# EAGLE design espruino (EAGLE 5.12)
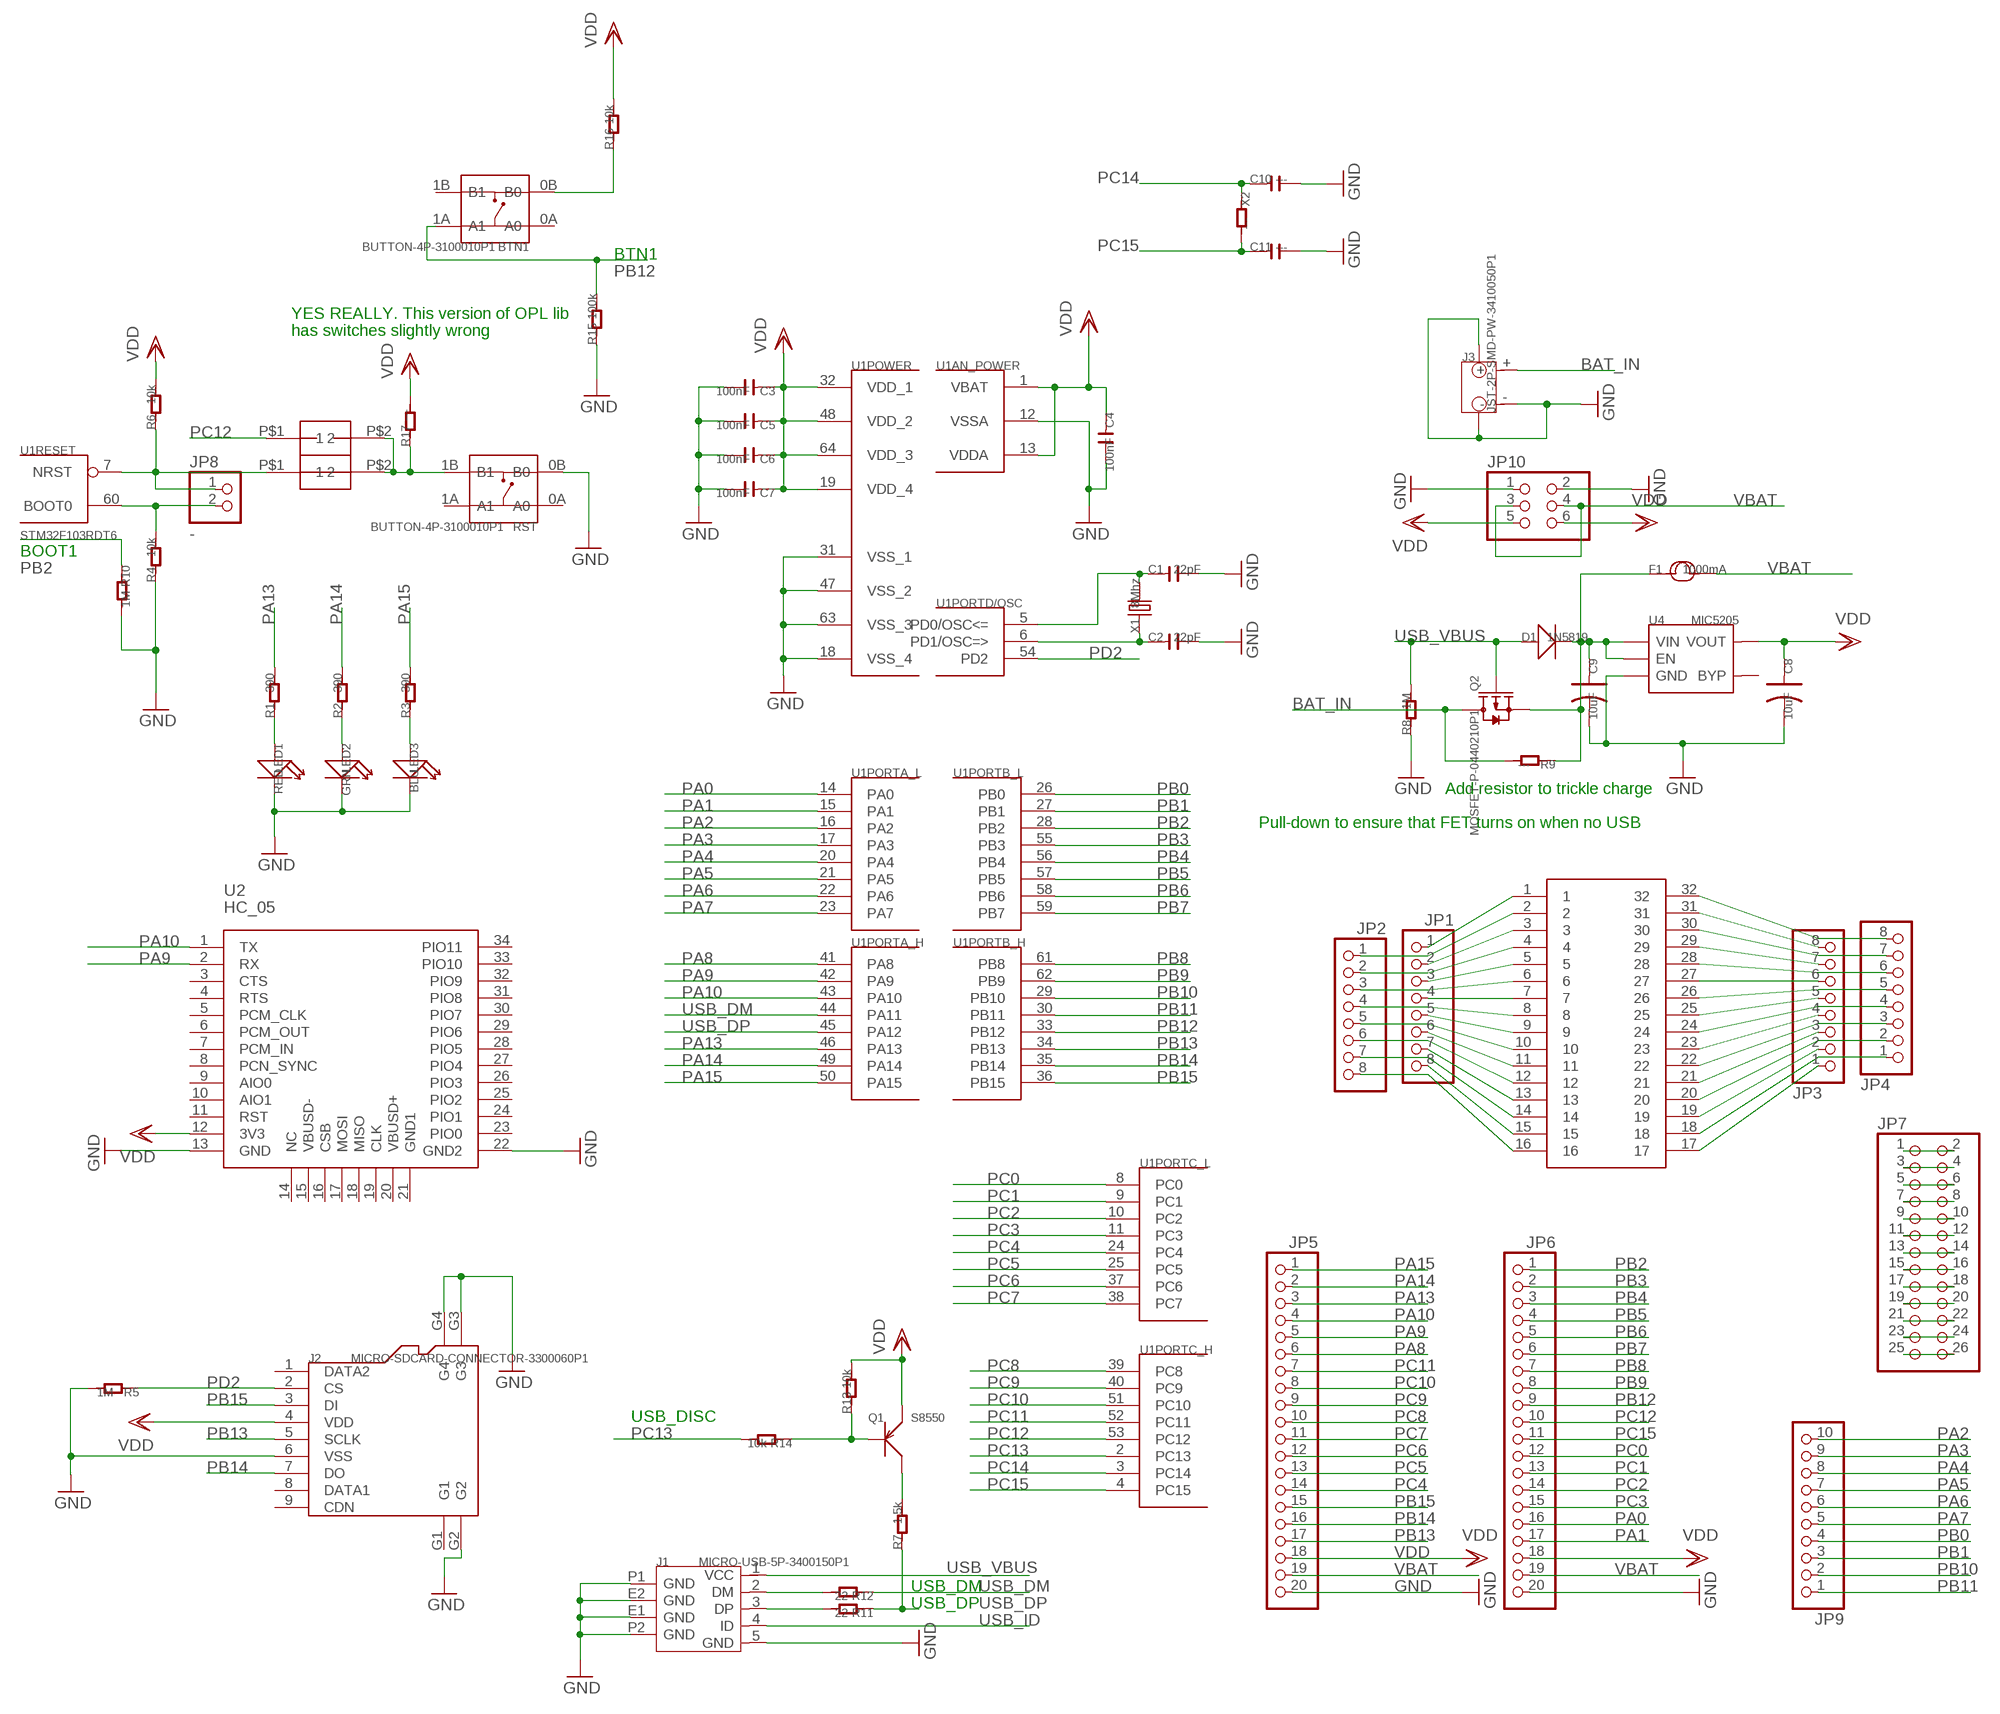
[diagram p0: schematic, sheet 1]

## Parts
BTN1  BUTTON-4P-3100010P1  [4P-SMD-6.0X6.0X5.0H]
C1  22pF  C-0603  [C0603]
C2  22pF  C-0603  [C0603]
C3  100nF  C-0603  [C0603]
C4  100nF  C-0603  [C0603]
C5  100nF  C-0603  [C0603]
C6  100nF  C-0603  [C0603]
C7  100nF  C-0603  [C0603]
C8  10uF  C-POLAR-A  [AVX-A]
C9  10uF  C-POLAR-A  [AVX-A]
C10  ---  C-0603  [C0603]
C11  ---  C-0603  [C0603]
D1  1N5819  D-SMA  [DO-214AC]
F1  1000mA  FUSE-1206  [F1206]
J1  MICRO-USB-5P-3400150P1  [B-SMD-5P]
J2  MICRO-SDCARD-CONNECTOR-3300060P1  [9P-SMD-W-RING]
J3  JST-2P-SMD-PW-3410050P1  [2P-SMD-2.0-90D]
JP1  PINHD-1X08_2.54-S  [1X08-S]
JP2  PINHD-1X08_2.54-S  [1X08-S]
JP3  PINHD-1X08_2.54-S  [1X08-S]
JP4  PINHD-1X08_2.54-S  [1X08-S]
JP5  PINHD-1X20_2.54-S  [1X20-S]
JP6  PINHD-1X20_2.54-S  [1X20-S]
JP7  PINHD-2X13_2.54  [2X13]
JP8  -  PINHD-1X02_2.54-S  [1X02-S]
JP9  PINHD-1X10_2.54-S  [1X10-S]
JP10  PINHD-2X3  [2X03]
LED1  RED  LED  [LED0603]
LED2  GRN  LED  [LED0603]
LED3  BLU  LED  [LED0603]
Q1  S8550  TRANSISTOR-PNP-0410030P1  [SOT23]
Q2  MOSFET-P-0440210P1  [SOT23]
R1  390  R-0603  [R0603]
R2  390  R-0603  [R0603]
R3  390  R-0603  [R0603]
R4  10k  R-0603  [R0603]
R5  1M  R-0603  [R0603]
R6  10k  R-0603  [R0603]
R7  1.5k  R-0603  [R0603]
R8  1M  R-0603  [R0603]
R9  ---  R-0603  [R0603]
R10  1M  R-0603  [R0603]
R11  22  R-0603  [R0603]
R12  22  R-0603  [R0603]
R13  10k  R-0603  [R0603]
R14  10k  R-0603  [R0603]
R15  100k  R-0603  [R0603]
R16  10k  R-0603  [R0603]
R17  ---  R-0603  [R0603]
RST  BUTTON-4P-3100010P1  [4P-SMD-6.0X6.0X5.0H]
U1  STM32F103RDT6  STM32F10XRXT6  [TQFP64]
U2  HC_05  [BLUETOOTH_SMD]
U4  MIC5205  MIC5205-3.3YM5-1300180P1  [SOT23-5]
U$1  SOIC32  [SO32X]
U$2  SOLDERJUMPER_SHORT  [SOLDERJUMPER_SHORT]
U$3  SOLDERJUMPER  [SOLDERJUMPER]
X1  8Mhz  CRYSTAL-0500290P1  [2P-SMD-5.0X3.2]
X2  ---  R-0603  [R0603]

## Nets
BAT_IN: J3.+ Q2.3(D) R9.2
GND: C1.2 C2.2 C3.2 C4.2 C5.2 C6.2 C7.2 C8.- C9.- C10.2 C11.2 J1.5(GND) J1.E1(GND) J1.E2(GND) J1.P1(GND) J1.P2(GND) J2.6(VSS) J2.G2 J2.G3 J2.G4 J3.3 J3.4 J3.- JP5.20 JP6.20 JP10.1 JP10.2 LED1.- LED2.- LED3.- R4.1 R5.2 R8.1 R10.2 R15.1 RST.0B(B0) U1.12(AN_POWER:VSSA) U1.18(POWER:VSS_4) U1.31(POWER:VSS_1) U1.47(POWER:VSS_2) U1.63(POWER:VSS_3) U2.13(GND) U2.22(GND2) U4.2(GND)
N$1: JP1.1 U$1.1
N$2: JP1.2 U$1.3
N$3: JP1.3 U$1.5
N$4: JP1.4 U$1.7
N$5: JP1.5 U$1.9
N$6: JP1.6 U$1.11
N$7: JP1.7 U$1.13
N$8: JP2.1 U$1.2
N$9: JP2.2 U$1.4
N$10: JP2.3 U$1.6
N$11: JP2.4 U$1.8
N$12: JP2.5 U$1.10
N$13: JP2.6 U$1.12
N$14: JP2.7 U$1.14
N$15: JP1.8 U$1.15
N$16: JP2.8 U$1.16
N$17: JP4.8 U$1.32
N$18: JP3.8 U$1.31
N$19: JP3.7 U$1.29
N$20: JP3.6 U$1.27
N$21: JP3.5 U$1.25
N$22: JP4.1 U$1.18
N$23: JP4.2 U$1.20
N$24: JP4.3 U$1.22
N$25: JP4.4 U$1.24
N$26: JP4.5 U$1.26
N$27: JP4.6 U$1.28
N$28: JP4.7 U$1.30
N$29: JP7.3 JP7.4
N$30: JP7.5 JP7.6
N$31: JP7.7 JP7.8
N$32: JP7.9 JP7.10
N$33: JP7.11 JP7.12
N$34: JP7.13 JP7.14
N$35: JP7.15 JP7.16
N$36: JP7.17 JP7.18
N$37: JP7.19 JP7.20
N$38: JP7.21 JP7.22
N$39: JP7.23 JP7.24
N$40: JP7.25 JP7.26
N$41: J1.3(DP) R11.2
N$42: J1.2(DM) R12.2
N$43: LED3.+ R3.1
N$44: JP3.4 U$1.23
N$45: JP8.1 R6.1 U1.7(RESET:NRST) U$2.P$1
N$46: JP8.2 R4.2 U1.60(RESET:BOOT0)
N$47: JP3.3 U$1.21
N$48: JP3.2 U$1.19
N$49: JP3.1 U$1.17
N$50: C2.1 U1.6(PORTD/OSC:PD1/OSC=>) X1.1
N$51: C1.1 U1.5(PORTD/OSC:PD0/OSC<=) X1.2
N$52: LED2.+ R2.1
N$53: LED1.+ R1.1
N$54: BTN1.0B(B0) R16.1
N$55: JP7.1 JP7.2
N$56: R17.1 RST.1B(B1) U$2.P$2 U$3.P$2
N$57: Q1.3(C) R7.2
N$58: C9.+ D1.2(-) F1.1 Q2.2(S) R9.1 U4.1(VIN) U4.3(EN)
N$59: Q1.1(B) R13.1 R14.1
PA0: JP6.16 U1.14(PORTA_L:PA0)
PA1: JP6.17 U1.15(PORTA_L:PA1)
PA2: JP9.10 U1.16(PORTA_L:PA2)
PA3: JP9.9 U1.17(PORTA_L:PA3)
PA4: JP9.8 U1.20(PORTA_L:PA4)
PA5: JP9.7 U1.21(PORTA_L:PA5)
PA6: JP9.6 U1.22(PORTA_L:PA6)
PA7: JP9.5 U1.23(PORTA_L:PA7)
PA8: JP5.6 U1.41(PORTA_H:PA8)
PA9: JP5.5 U1.42(PORTA_H:PA9) U2.2(RX)
PA10: JP5.4 U1.43(PORTA_H:PA10) U2.1(TX)
PA13: JP5.3 R1.2 U1.46(PORTA_H:PA13)
PA14: JP5.2 R2.2 U1.49(PORTA_H:PA14)
PA15: JP5.1 R3.2 U1.50(PORTA_H:PA15)
PB0: JP9.4 U1.26(PORTB_L:PB0)
PB1: JP9.3 U1.27(PORTB_L:PB1)
PB2: JP6.1 R10.1 U1.28(PORTB_L:PB2)
PB3: JP6.2 U1.55(PORTB_L:PB3)
PB4: JP6.3 U1.56(PORTB_L:PB4)
PB5: JP6.4 U1.57(PORTB_L:PB5)
PB6: JP6.5 U1.58(PORTB_L:PB6)
PB7: JP6.6 U1.59(PORTB_L:PB7)
PB8: JP6.7 U1.61(PORTB_H:PB8)
PB9: JP6.8 U1.62(PORTB_H:PB9)
PB10: JP9.2 U1.29(PORTB_H:PB10)
PB11: JP9.1 U1.30(PORTB_H:PB11)
PB12: BTN1.1A(A1) JP6.9 R15.2 U1.33(PORTB_H:PB12)
PB13: J2.5(SCLK) JP5.17 U1.34(PORTB_H:PB13)
PB14: J2.7(DO) JP5.16 U1.35(PORTB_H:PB14)
PB15: J2.3(DI) JP5.15 U1.36(PORTB_H:PB15)
PC0: JP6.12 U1.8(PORTC_L:PC0)
PC1: JP6.13 U1.9(PORTC_L:PC1)
PC2: JP6.14 U1.10(PORTC_L:PC2)
PC3: JP6.15 U1.11(PORTC_L:PC3)
PC4: JP5.14 U1.24(PORTC_L:PC4)
PC5: JP5.13 U1.25(PORTC_L:PC5)
PC6: JP5.12 U1.37(PORTC_L:PC6)
PC7: JP5.11 U1.38(PORTC_L:PC7)
PC8: JP5.10 U1.39(PORTC_H:PC8)
PC9: JP5.9 U1.40(PORTC_H:PC9)
PC10: JP5.8 U1.51(PORTC_H:PC10)
PC11: JP5.7 U1.52(PORTC_H:PC11)
PC12: JP6.10 U1.53(PORTC_H:PC12) U$3.P$1
PC13: R14.2 U1.2(PORTC_H:PC13)
PC14: C10.1 U1.3(PORTC_H:PC14) X2.1
PC15: C11.1 JP6.11 U1.4(PORTC_H:PC15) X2.2
PD2: J2.2(CS) R5.1 U1.54(PORTD/OSC:PD2)
USB_DM: R12.1 U1.44(PORTA_H:PA11)
USB_DP: R7.1 R11.1 U1.45(PORTA_H:PA12)
USB_ID: J1.4(ID)
USB_VBUS: D1.1(+) J1.1(VCC) Q2.1(G) R8.2
VBAT: F1.2 JP5.19 JP6.19 JP10.3 JP10.4
VDD: C3.1 C4.1 C5.1 C6.1 C7.1 C8.+ J2.4(VDD) JP5.18 JP6.18 JP10.5 JP10.6 Q1.2(E) R6.2 R13.2 R16.2 R17.2 U1.1(AN_POWER:VBAT) U1.13(AN_POWER:VDDA) U1.19(POWER:VDD_4) U1.32(POWER:VDD_1) U1.48(POWER:VDD_2) U1.64(POWER:VDD_3) U2.12(3V3) U4.5(VOUT)
Unconnected: BTN1.0A(A0) BTN1.1B(B1) J2.1(DATA2) J2.8(DATA1) J2.9(CDN) J2.G1 RST.0A(A0) RST.1A(A1) U2.3(CTS) U2.4(RTS) U2.5(PCM_CLK) U2.6(PCM_OUT) U2.7(PCM_IN) U2.8(PCN_SYNC) U2.9(AIO0) U2.10(AIO1) U2.11(RST) U2.14(NC) U2.15(VBUSD-) U2.16(CSB) U2.17(MOSI) U2.18(MISO) U2.19(CLK) U2.20(VBUSD+) U2.21(GND1) U2.23(PIO0) U2.24(PIO1) U2.25(PIO2) U2.26(PIO3) U2.27(PIO4) U2.28(PIO5) U2.29(PIO6) U2.30(PIO7) U2.31(PIO8) U2.32(PIO9) U2.33(PIO10) U2.34(PIO11) U4.4(BYP)

## Notes on the sheet
- BTN1
- YES REALLY. This version of OPL lib
- has switches slightly wrong
- BOOT1
- Add resistor to trickle charge
- Pull-down to ensure that FET turns on when no USB
- USB_DISC
- USB_DM
- USB_DP

## Library data of the parts
BTN1 RST = OPL5:BUTTON-4P
C1-C7 C10 C11 = OPL5:C*
C8 C9 = OPL5:C-POLAR*
D1 = OPL5:D*: DIODE
F1 = OPL5:FUSE*
J1 = OPL5:MICRO-USB-5P: ST-USB-001E?MICRO USB B SMD R/A
J2 = OPL5:MICRO-SDCARD-CONNECTOR: Micro SD Card
J3 = OPL5:JST-2P-SMD-PW
JP1-JP4 = pinhead-2:PINHD-1X08: PIN HEADER
JP5 JP6 = pinhead-2:PINHD-1X20: PIN HEADER
JP7 = pinhead-2:PINHD-2X13: PIN HEADER
JP8 = pinhead-2:PINHD-1X02: PIN HEADER
JP9 = pinhead-2:PINHD-1X10: PIN HEADER
JP10 = pinhead:PINHD-2X3: PIN HEADER
LED1-LED3 = OPL5:LED*: LED
Q1 = OPL5:TRANSISTOR-PNP*: S8550?PNP Transistor
Q2 = OPL5:MOSFET-P: CJ2305?SMD MOSFET P-CH 8V-4.1A
R1-R17 X2 = OPL5:R*
U1 = stm32:STM32F10XRXT6: STM32F101/103 64pin LQFP
U2 = bluetooth:HC_05
U4 = OPL5:MIC5205-3.3YM5: The MIC5205 is an efficient linear voltage regulator with ultra-low-noise output, very low dropout voltage (typically 17mV at light loads and 165mV at 150mA), and very low ground current (600µA at 100mA output). The MIC5205 offers better than 1% initial accuracy. datasheet here: http://www.micrel.com/product-info/prod/5205.shtml
U$1 = longpad:SOIC32
U$2 = solderjumper:SOLDERJUMPER_SHORT
U$3 = solderjumper:SOLDERJUMPER
X1 = OPL5:CRYSTAL*

## Board
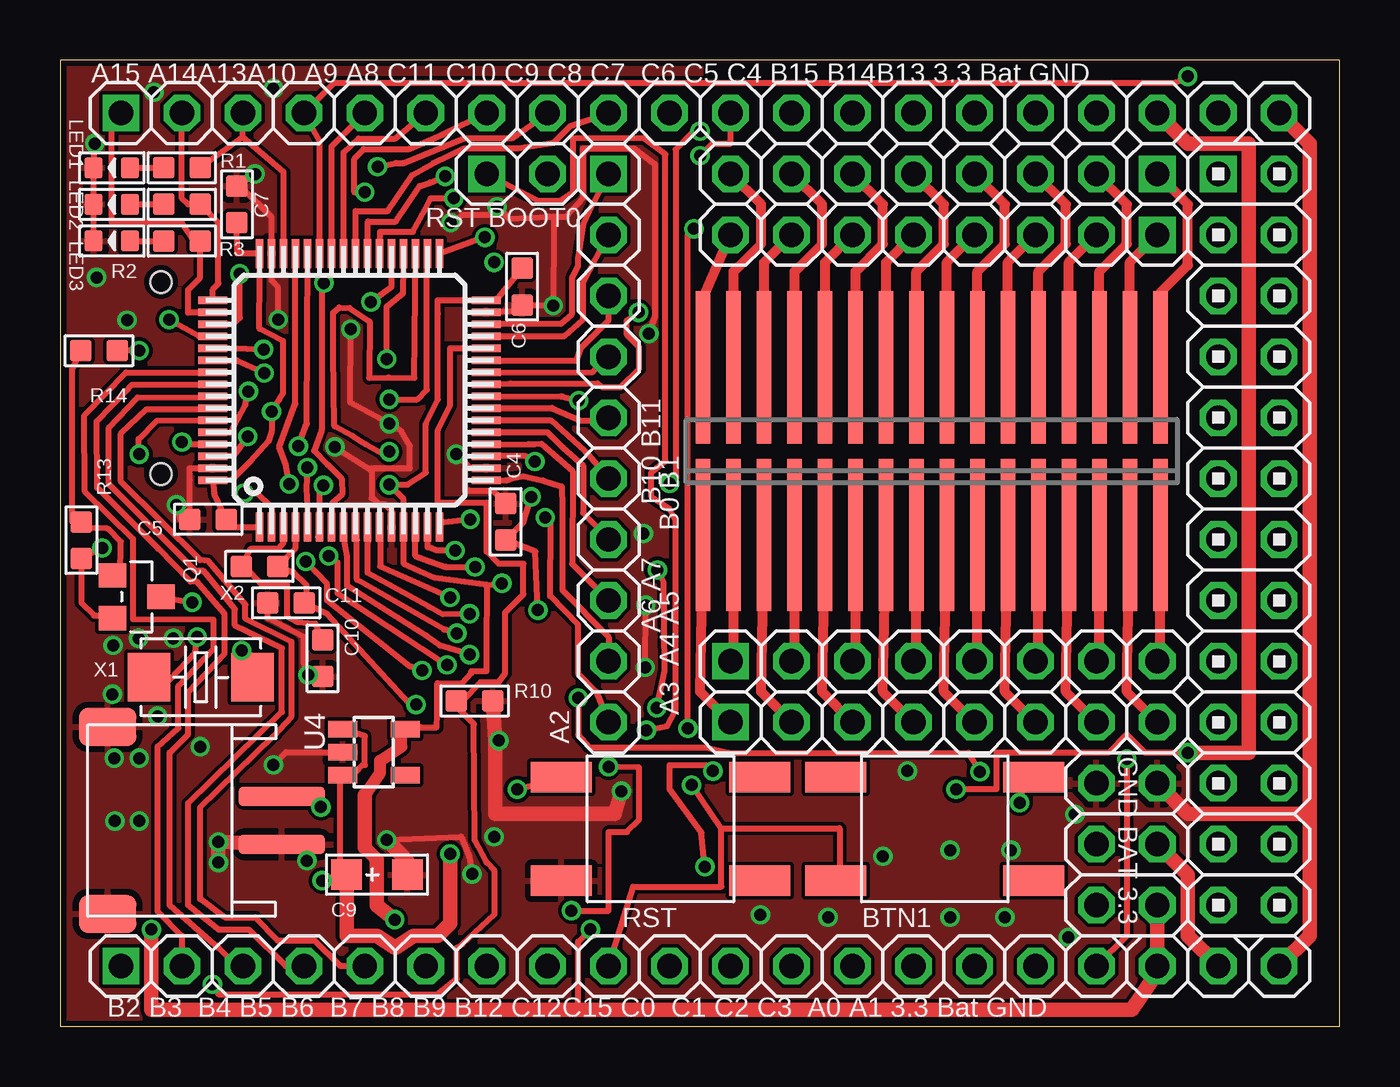
[diagram p1: board, top side]
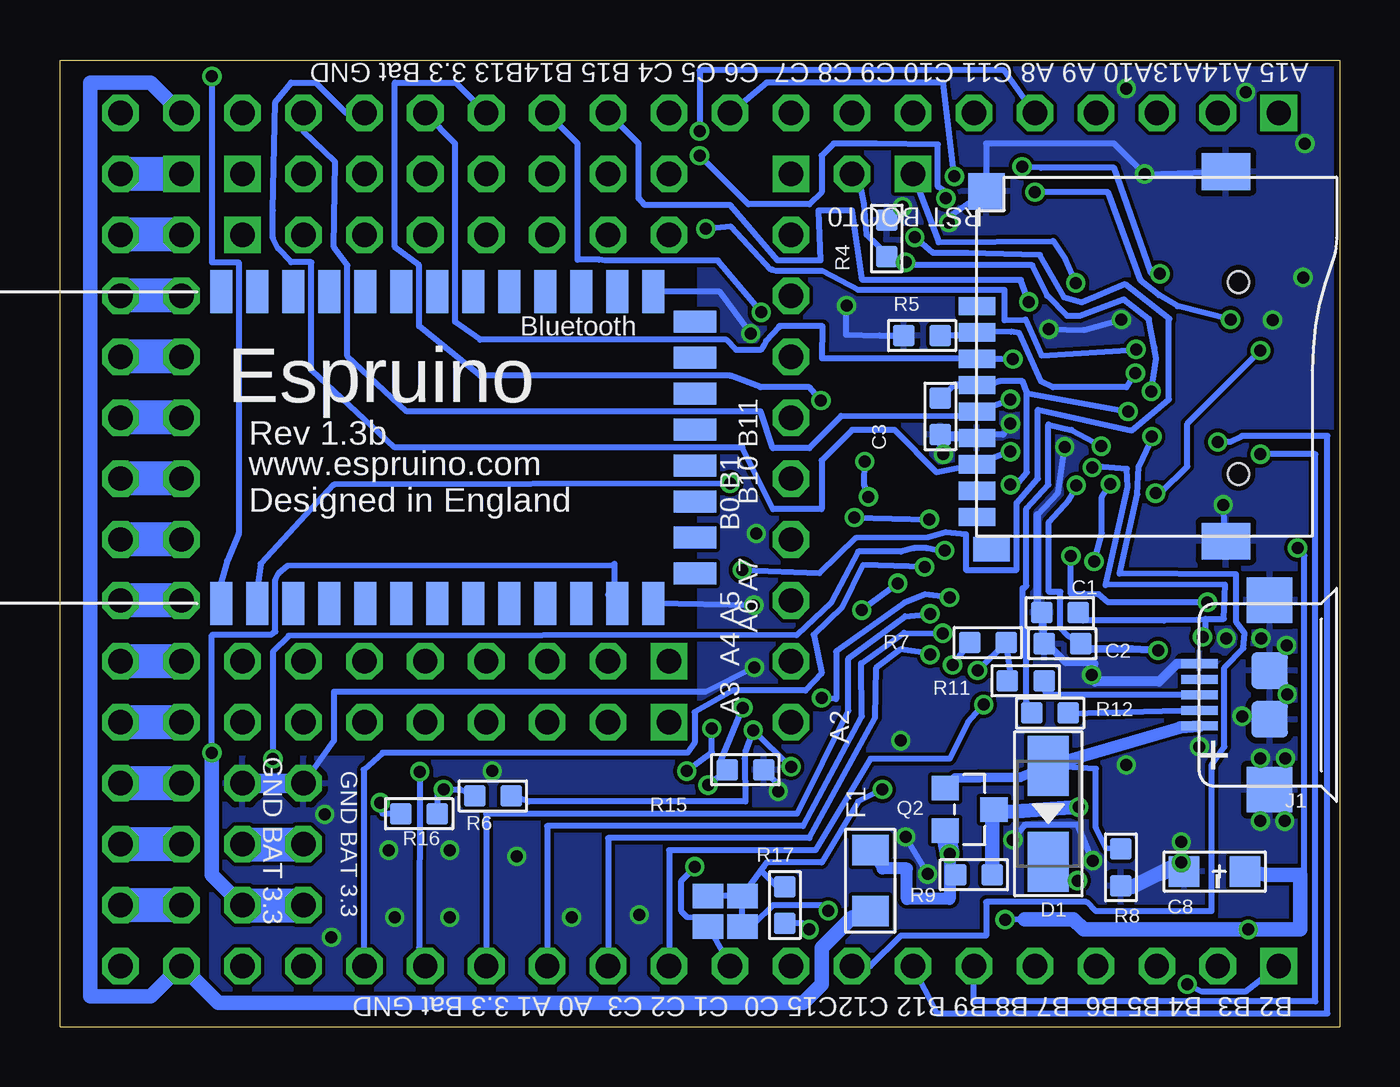
[diagram p2: board, bottom side, seen from below]

Size 53.32 x 40.31 mm. Coordinates in mm from the lower left corner, seen from the top.
Outline: 53.32,0 53.32,0
Outline: 53.32,0 53.32,40.31 0,40.31 0,0 53.32,0
Copper layers (1*16): Top 0.035mm / dielectric 1.5mm / Bottom 0.035mm
Design rules "SeeedStudio_rule_no_angle_090911 *": minimum track width 6mil, minimum drill 12mil, track to track 6mil, track to pad 6mil, pad to pad 6mil, via to via 6mil, smd to smd 0mil, copper to edge 10mil, drill to drill 10mil, minimum pad ring 10mil, minimum via ring 6mil, stop-mask expansion 2mil, vias tented up to drill 100mil, thermal gap 10mil

### Footprints (pad centres in the part's own frame; a part is rotated, then mirrored left to right if it is on the bottom)
4P-SMD-6.0X6.0X5.0H = smd 2.54 x 1.27: 0A -4.129,2.159; 0B 4.129,2.159; 1A -4.129,-2.159; 1B 4.129,-2.159
C0603 = smd 0.889 x 0.889: 1 -0.762,0; 2 0.762,0
AVX-A = smd 1.27 x 1.27: + -1.27,0; - 1.27,0
DO-214AC = smd 2.5 x 1.7: 1 -2,0; 2 2,0
F1206 = smd 1.27 x 1.524: 1 -1.27,0; 2 1.27,0
B-SMD-5P = smd 0.38 x 1.52: 1 -1.3,2.54; 2 -0.65,2.54; 3 0,2.54; 4 0.65,2.54; 5 1.3,2.54 | smd 1.524 x 1.524: E1 -1.016,-0.381; E2 1.016,-0.381 | smd 1.9 x 1.9: P1 -3.95,-0.381; P2 3.95,-0.381
9P-SMD-W-RING = smd 1.524 x 0.762: 1 -7.493,2.114; 2 -7.493,1.014; 3 -7.493,-0.086; 4 -7.493,-1.186; 5 -7.493,-2.286; 6 -7.493,-3.386; 7 -7.493,-4.486; 8 -7.493,-5.586; 9 -7.493,-6.686 | smd 1.524 x 1.016: G1 -6.893,-8.032 | smd 2.032 x 1.524: G2 2.88,-7.686; G3 2.88,7.714 | smd 1.524 x 1.524: G4 -7.101,6.895 | hole 0.889: 3.407,-4.886; 3.407,3.114
2P-SMD-2.0-90D = smd 1.6 x 2.4: 3 3.9,-2.181; 4 -3.9,-2.181 | smd 0.8 x 3.6: + -1,5.08; - 1,5.08
1X08-S = drill 1.016 square: 1 -8.89,0 | drill 1.016 octagon: 2 -6.35,0; 3 -3.81,0; 4 -1.27,0; 5 1.27,0; 6 3.81,0; 7 6.35,0; 8 8.89,0
1X20-S = drill 1.016 square: 1 -24.13,0 | drill 1.016 octagon: 2 -21.59,0; 3 -19.05,0; 4 -16.51,0; 5 -13.97,0; 6 -11.43,0; 7 -8.89,0; 8 -6.35,0; 9 -3.81,0; 10 -1.27,0; 11 1.27,0; 12 3.81,0; 13 6.35,0; 14 8.89,0; 15 11.43,0; 16 13.97,0; 17 16.51,0; 18 19.05,0; 19 21.59,0; 20 24.13,0
2X13 = drill 1.016 square: 1 -15.24,-1.27 | drill 1.016 octagon: 2 -15.24,1.27; 3 -12.7,-1.27; 4 -12.7,1.27; 5 -10.16,-1.27; 6 -10.16,1.27; 7 -7.62,-1.27; 8 -7.62,1.27; 9 -5.08,-1.27; 10 -5.08,1.27; 11 -2.54,-1.27; 12 -2.54,1.27; 13 0,-1.27; 14 0,1.27; 15 2.54,-1.27; 16 2.54,1.27; 17 5.08,-1.27; 18 5.08,1.27; 19 7.62,-1.27; 20 7.62,1.27; 21 10.16,-1.27; 22 10.16,1.27; 23 12.7,-1.27; 24 12.7,1.27; 25 15.24,-1.27; 26 15.24,1.27
1X02-S = drill 1.016 square: 1 -1.27,0 | drill 1.016 octagon: 2 1.27,0
1X10-S = drill 1.016 square: 1 -11.43,0 | drill 1.016 octagon: 2 -8.89,0; 3 -6.35,0; 4 -3.81,0; 5 -1.27,0; 6 1.27,0; 7 3.81,0; 8 6.35,0; 9 8.89,0; 10 11.43,0
2X03 = drill 1.016 octagon: 1 -2.54,-1.27; 2 -2.54,1.27; 3 0,-1.27; 4 0,1.27; 5 2.54,-1.27; 6 2.54,1.27
LED0603 = smd 0.762 x 0.889: + -0.762,0; - 0.762,0
SOT23 = smd 1.016 x 1.143: 1 -0.889,-1.016; 2 0.889,-1.016; 3 0,1.016
R0603 = smd 0.889 x 0.889: 1 -0.762,0; 2 0.762,0
TQFP64 = smd 1.2 x 0.3: 1 -5.7,3.75; 2 -5.7,3.25; 3 -5.7,2.75; 4 -5.7,2.25; 5 -5.7,1.75; 6 -5.7,1.25; 7 -5.7,0.75; 8 -5.7,0.25; 9 -5.7,-0.25; 10 -5.7,-0.75; 11 -5.7,-1.25; 12 -5.7,-1.75; 13 -5.7,-2.25; 14 -5.7,-2.75; 15 -5.7,-3.25; 16 -5.7,-3.75; 33 5.7,-3.75; 34 5.7,-3.25; 35 5.7,-2.75; 36 5.7,-2.25; 37 5.7,-1.75; 38 5.7,-1.25; 39 5.7,-0.75; 40 5.7,-0.25; 41 5.7,0.25; 42 5.7,0.75; 43 5.7,1.25; 44 5.7,1.75; 45 5.7,2.25; 46 5.7,2.75; 47 5.7,3.25; 48 5.7,3.75 | smd 0.3 x 1.2: 17 -3.75,-5.7; 18 -3.25,-5.7; 19 -2.75,-5.7; 20 -2.25,-5.7; 21 -1.75,-5.7; 22 -1.25,-5.7; 23 -0.75,-5.7; 24 -0.25,-5.7; 25 0.25,-5.7; 26 0.75,-5.7; 27 1.25,-5.7; 28 1.75,-5.7; 29 2.25,-5.7; 30 2.75,-5.7; 31 3.25,-5.7; 32 3.75,-5.7; 49 3.75,5.7; 50 3.25,5.7; 51 2.75,5.7; 52 2.25,5.7; 53 1.75,5.7; 54 1.25,5.7; 55 0.75,5.7; 56 0.25,5.7; 57 -0.25,5.7; 58 -0.75,5.7; 59 -1.25,5.7; 60 -1.75,5.7; 61 -2.25,5.7; 62 -2.75,5.7; 63 -3.25,5.7; 64 -3.75,5.7
BLUETOOTH_SMD = smd 1.778 x 0.914: 1 0,0; 2 0,-1.5; 3 0,-3; 4 0,-4.5; 5 0,-6; 6 0,-7.5; 7 0,-9; 8 0,-10.5; 9 0,-12; 10 0,-13.5; 11 0,-15; 12 0,-16.5; 13 0,-18; 22 13,-18; 23 13,-16.5; 24 13,-15; 25 13,-13.5; 26 13,-12; 27 13,-10.5; 28 13,-9; 29 13,-7.5; 30 13,-6; 31 13,-4.5; 32 13,-3; 33 13,-1.5; 34 13,0 | smd 0.914 x 1.778: 14 1.25,-19.75; 15 2.75,-19.75; 16 4.25,-19.75; 17 5.75,-19.75; 18 7.25,-19.75; 19 8.75,-19.75; 20 10.25,-19.75; 21 11.75,-19.75
SOT23-5 = smd 0.69 x 1.2: 1 -0.95,-1.3; 2 0,-1.3; 3 0.95,-1.3; 4 0.95,1.3; 5 -0.95,1.3
SO32X = smd 0.6 x 6.35: 1 -9.525,-3.495; 2 -8.255,-3.495; 3 -6.985,-3.495; 4 -5.715,-3.495; 5 -4.445,-3.495; 6 -3.175,-3.495; 7 -1.905,-3.495; 8 -0.635,-3.495; 9 0.635,-3.495; 10 1.905,-3.495; 11 3.175,-3.495; 12 4.445,-3.495; 13 5.715,-3.495; 14 6.985,-3.495; 15 8.255,-3.495; 16 9.525,-3.495; 17 9.525,3.495; 18 8.255,3.495; 19 6.985,3.495; 20 5.715,3.495; 21 4.445,3.495; 22 3.175,3.495; 23 1.905,3.495; 24 0.635,3.495; 25 -0.635,3.495; 26 -1.905,3.495; 27 -3.175,3.495; 28 -4.445,3.495; 29 -5.715,3.49; 30 -6.985,3.49; 31 -8.255,3.49; 32 -9.525,3.49
SOLDERJUMPER_SHORT = smd 1.27 x 1.016: P$1 0,0.635; P$2 0,-0.635
SOLDERJUMPER = smd 1.27 x 1.016: P$1 0,0.635; P$2 0,-0.635
2P-SMD-5.0X3.2 = smd 1.778 x 2.032: 1 -2.159,0; 2 2.159,0

### Placement (x,y rotation side)
BTN1  36.45,8.26 0 top
C1  11.66,17.27 180 bottom
C2  11.56,15.98 180 bottom
C3  16.64,25.45 270 bottom
C4  18.57,21.06 90 top
C5  6.17,21.16 180 top
C6  19.25,30.86 270 top
C7  7.37,34.29 90 top
C8  5.21,6.48 180 bottom
C9  13.21,6.35 0 top
C10  10.95,15.37 270 top
C11  9.42,17.68 180 top
D1  12.14,8.89 270 bottom
F1  19.56,6.1 270 bottom
J1  3.3,13.84 90 bottom
J2  7.62,27.94 0 bottom
J3  4.17,8.61 270 top
JP1  36.83,12.7 0 top
JP2  36.83,15.24 0 top
JP3  36.83,35.56 180 top
JP4  36.83,33.02 180 top
JP5  26.67,38.1 0 top
JP6  26.67,2.54 0 top
JP7  49.53,20.32 270 top
JP8  19.05,35.56 0 top
JP9  22.86,24.13 270 top
JP10  44.45,7.62 270 top
LED1  2.16,35.81 180 top
LED2  2.16,34.29 180 top
LED3  2.16,32.77 180 top
Q1  3.2,17.93 270 top
Q2  15.42,9.07 270 bottom
R1  5.08,35.81 0 top
R2  5.08,34.29 0 top
R3  5.08,32.77 0 top
R4  18.87,32.87 270 bottom
R5  17.4,28.83 180 bottom
R6  35.28,9.63 180 bottom
R7  14.66,16.03 180 bottom
R8  9.12,6.65 90 bottom
R9  15.24,6.35 0 bottom
R10  17.27,13.59 0 top
R11  13.08,14.43 0 bottom
R12  12.06,13.08 0 bottom
R13  0.89,20.29 270 top
R14  1.63,28.19 0 top
R15  24.77,10.72 180 bottom
R16  38.35,8.89 0 bottom
R17  23.11,5.08 270 bottom
RST  25.02,8.26 180 top
U1  12.06,26.54 90 top
U2  46.61,17.65 90 bottom
U4  13.08,11.46 270 top
U$1  36.32,24 0 top
U$2  24.89,4.83 180 bottom
U$3  26.31,4.83 180 bottom
X1  5.87,14.58 180 top
X2  8.31,19.2 0 top

### Tracks (layer width: path | path; a pad name or v marks a point on that pad's centre or on a via)
BAT_IN  (via drill 0.5)
  Top 0.61: J3.+ 10.66,9.61 v10.87,9.17
  Bottom 0.254: 14.48,8.64 Q2.3 14.17,8.94
  Bottom 0.61: 14.48,8.64 R9.2 | v10.87,9.17 13.21,9.02 14.17,8.94
GND  (via drill 0.5)
  Top 0.254: U1.63 5.4,23.29 5.41,22.78 C5.2 5,21.16 v4.85,21.77 | 19.1,29.84 U1.31 | 19.1,29.84 C6.2 19.38,30.23 | U1.47 8.81,32.71 | v24.54,28.91 24.79,29.62 24.79,35.97 23.9,36.63 21.79,36.63 21.79,34.57 21.08,33.78 20.57,33.78 | C4.2 18.03,22.35 16.87,22.35 16.87,23.27 16.94,23.29 17,23.29 U1.18 17.09,23.29 v16.51,23.88 | 12.98,23.19 12.98,23.29 14.58,23.29 14.58,24.23 14.22,24.84 v13.72,25.15 12.09,26.04 v12.12,29.08 | 12.98,23.19 12.98,22.05 13.03,22.05 13.28,21.79 13.54,21.79 13.84,21.49 13.84,20.87 U1.12 | v24.38,14.99 v24.41,17.58 | v8.13,35.56 C7.2 7.52,35.05 8.81,33.76 U1.47 | v16.28,33.53 16.79,33.86 18.06,33.86 | 18.06,33.86 18.34,34.11 18.69,33.71 20.4,33.78 20.57,33.78 | U1.47 8.81,31.11 9.09,30.81 v9.09,29.49 | v11.46,24.18 12.98,23.19 | 6.6,7.62 10.29,7.72 | v13.61,7.8 16.71,7.92 17.04,7.09 v17.17,6.38 | U4.2 9.42,11.46 v8.89,10.92 | 18.06,33.86 v18.21,34.19 | LED3.- LED2.- LED1.- 1.4,35.94 v1.45,36.83 | 10.16,15.24 10.16,15.16 10.46,14.66 | 10.16,15.24 10.16,16.26 8.66,17.04 C11.2 | 10.46,14.66 C10.2 | 10.16,15.24 v10.34,14.68 arc-90 10.49,14.68 10.46,14.66 | 20.57,33.78 20.57,33.27 v20.55,30.07 19.3,30.07 19.3,29.97 19.1,29.84
  Top 0.61: JP10.2 46.99,8.89 52.07,8.89 | 52.07,8.89 52.07,3.81 JP6.20 | JP5.20 52.07,36.83 52.07,8.89 | v6.6,6.86 v6.6,7.71 J3.- | R10.2 18.14,11.96 18.14,8.89 23.11,8.89 v23.39,9.83 | 10.29,7.72 v10.29,6.93 | v13.61,7.8 14.48,6.93 C9.-
  Bottom 0.254: 28.48,17.78 U2.13 v24.41,17.58 | R5.2 19.18,28.83 20.57,28.85 20.57,29.72 v20.55,30.07 | U2.22 25.83,30.65 v24.54,28.91 | J2.G2 v4.85,21.77 | 8.59,5.89 C8.- 7.96,6.18 8.47,6.01 8.64,5.84 | C2.2 12.17,15.98 | v16.51,23.88 16.76,24.56 C3.2 | J2.6 16.5,24.55 C3.2 | C3.2 14.02,24.69 v13.72,25.15 | v24.38,14.99 26.42,13.97 41.91,13.97 41.91,11.94 JP10.1 | J2.G3 v8.13,35.56 9.4,36.83 14.73,36.83 J2.G4 16.26,33.78 v16.28,33.53 | v12.12,29.08 10.67,29.06 v9.09,29.49 | 12.6,21.34 11.73,22.28 v11.46,24.18 | v10.29,6.93 10.92,8.43 13.13,8.43 v13.61,7.8 | v17.17,6.38 v18.09,7.92 | v18.21,34.19 R4.1 | 10.31,15.19 v10.34,14.68 | v23.39,9.83 23.39,10.11 R15.1
  Bottom 0.305: C2.2 C1.2 12.6,17.27 12.6,21.34 | 10.26,15.14 10.31,15.19 11.4,15.19 12.19,15.98
  Bottom 0.406: J1.5 6.78,15.14 7.52,14.4 10.19,14.4 10.26,14.48 10.26,15.14 | 12.19,15.98 C2.2
  Bottom 0.61: 8.59,5.89 R8.1 | 8.64,5.84 v6.6,6.86
  Bottom 0.813: JP10.1 JP10.2
  other vias: 1.52,31.24 8.89,39.12 3.91,38.96 29.18,4.67 32,4.57 37.08,4.57 42.01,3.73 42.29,8.86 18.29,11.94 39.62,7.37 39.37,4.57 2.26,11.2 3.3,8.59 4.72,16.21 3.28,16.21 5.84,11.68 4.06,12.95 2.29,8.59 34.29,7.11 37.08,7.37 24.31,20.57 2.79,29.46 2.21,15.9 2.18,13.87 3.3,11.2 35.31,10.67
  pour Bottom: 0,40.13 26.67,40.13 26.67,11.18 46.99,11.18 46.99,0 0,0
  pour Top: 0.25,40.13 26.67,40.13 26.67,11.18 46.99,11.18 46.99,0 0.25,0
N$1
  Top 0.406: JP1.1 26.67,13.97 U$1.1
N$2
  Top 0.406: JP1.2 29.21,13.97 U$1.3
N$3
  Top 0.406: JP1.3 31.75,13.97 U$1.5
N$4
  Top 0.406: JP1.4 34.29,13.97 U$1.7
N$5
  Top 0.406: JP1.5 36.83,13.97 U$1.9
N$6
  Top 0.406: JP1.6 39.37,13.97 U$1.11
N$7
  Top 0.406: JP1.7 41.91,13.97 U$1.13
N$8
  Top 0.406: JP2.1 28.07,15.37 U$1.2
N$9
  Top 0.406: JP2.2 30.61,15.37 U$1.4
N$10
  Top 0.406: JP2.3 33.15,15.37 U$1.6
N$11
  Top 0.406: JP2.4 35.69,15.37 U$1.8
N$12
  Top 0.406: JP2.5 38.23,15.37 U$1.10
N$13
  Top 0.406: JP2.6 40.77,15.37 U$1.12
N$14
  Top 0.406: JP2.7 43.31,15.37 U$1.14
N$15
  Top 0.406: JP1.8 44.45,13.97 U$1.15
N$16
  Top 0.406: JP2.8 45.85,15.37 U$1.16
N$17
  Top 0.406: JP4.8 26.85,30.48 U$1.32
N$18
  Top 0.406: JP3.8 29.21,34.29 29.21,32.64 28.07,31.5 U$1.31
N$19
  Top 0.406: JP3.7 31.75,34.29 31.75,32.64 30.61,31.5 U$1.29
N$20
  Top 0.406: JP3.6 34.29,34.29 34.29,32.64 33.15,31.5 U$1.27
N$21
  Top 0.406: JP3.5 36.83,34.29 36.83,32.64 35.69,31.5 U$1.25
N$22
  Top 0.406: JP4.1 44.58,31.88 U$1.18
N$23
  Top 0.406: JP4.2 42.04,31.88 U$1.20
N$24
  Top 0.406: JP4.3 39.5,31.88 U$1.22
N$25
  Top 0.406: JP4.4 36.96,31.88 U$1.24
N$26
  Top 0.406: JP4.5 34.42,31.88 U$1.26
N$27
  Top 0.406: JP4.6 31.88,31.88 U$1.28
N$28
  Top 0.406: JP4.7 29.34,31.88 U$1.30
N$29
  Bottom 1.422: JP7.3 JP7.4
N$30
  Bottom 1.422: JP7.5 JP7.6
N$31
  Bottom 1.422: JP7.7 JP7.8
N$32
  Bottom 1.422: JP7.9 JP7.10
N$33
  Bottom 1.422: JP7.11 JP7.12
N$34
  Bottom 1.422: JP7.13 JP7.14
N$35
  Bottom 1.422: JP7.15 JP7.16
N$36
  Bottom 1.422: JP7.17 JP7.18
N$37
  Bottom 1.422: JP7.19 JP7.20
N$38
  Bottom 1.422: JP7.21 JP7.22
N$39
  Bottom 1.422: JP7.23 JP7.24
N$40
  Bottom 1.422: JP7.25 JP7.26
N$41
  Bottom 0.254: J1.3 12.24,13.84 R11.2
N$42
  Bottom 0.254: J1.2 11.27,13.04 R12.2
N$43
  Top 0.254: LED3.+ R3.1
N$44
  Top 0.406: JP3.4 39.37,34.29 39.37,32.64 38.23,31.5 U$1.23
N$45  (via drill 0.5)
  Top 0.254: v11,31.01 10.9,30.76 10.9,24.89 10.59,24.03 11.15,23.44 11.73,22.86 11.76,22.2 11.35,21.84 11.33,21.72 U1.7 | v24.43,12.37 25.3,12.55 25.65,13.21 25.65,21.08 25.4,21.59 24.64,22.1 24.64,23.11 25.22,23.6 25.22,36.37 24.33,37.06 21.36,37.03 21.36,34.77 20.83,34.42 19.94,34.42 JP8.1 | v22.86,10.85 23.11,10.85 24.13,10.82 24.13,8.64 23.62,8.13 22.86,8.13 22.86,4.85 v21.31,4.85
  Bottom 0.254: v11,31.01 11.43,32 11.94,32.77 16.71,32.72 JP8.1 | v22.86,10.85 v24.43,12.37 24.77,11.48 24.79,11.18 24.77,9.4 33.78,9.4 R6.1 | v21.31,4.85 21.59,5.08 23.62,5.08 24.38,4.32 24.77,4.32 U$2.P$1
N$46  (via drill 0.5)
  Top 0.254: v7.85,26.49 7.72,25.93 7.09,24.77 U1.60
  Bottom 0.254: JP8.2 20.07,35.56 19.81,34.29 19.71,33.02 18.36,31.75 | 18.36,31.75 12.8,31.75 12.19,30.48 11.35,29.64 10.82,29.64 8.99,30.33 7.95,29.52 7.72,28.32 7.64,27.86 v7.85,26.49 | 18.36,31.75 v18.09,31.88 R4.2
N$47
  Top 0.406: JP3.3 41.91,34.29 41.91,32.64 40.77,31.5 U$1.21
N$48
  Top 0.406: JP3.2 44.45,34.29 44.45,32.64 43.31,31.5 U$1.19
N$49
  Top 0.254: U$1.17 45.85,30.61
  Top 0.406: JP3.1 46.99,34.29 46.99,31.75 45.85,30.61
N$50  (via drill 0.5)
  Top 0.254: 7.52,14.38 X1.1 | v10.97,22.58 10.79,22.38 10.79,21.46 10.77,20.38 U1.6
  Top 0.305: v7.57,15.7 8.53,15.14 X1.1
  Bottom 0.254: v10.97,22.58 11,22.45 11.28,22 12.12,21.06 12.12,18.14 11.63,18.14 11.63,16.66 11.66,16.66 11.33,16.31 C2.1 11.07,16
  Bottom 0.305: C2.1 10.57,15.75 8.64,15.75 v7.57,15.7
N$51  (via drill 0.5)
  Top 0.254: U1.5 10.31,21.18 10.31,21.34 10.31,21.69 10.26,22.45 v10.31,23.32 | v5.71,16.26 5.64,15.62 4.57,14.48 3.56,14.25 X1.2
  Bottom 0.254: v5.71,16.26 5.59,16.51 5.59,17.02 | 5.59,17.02 5.51,16.99 5.94,16.97 7.32,16.94 10.69,16.94 10.9,17.04 C1.1 | v10.31,23.32 9.88,23.34 8.87,23.27 8.84,22.5 9.75,18.41 4.78,18.44 4.83,17.02 5.59,17.02
N$52
  Top 0.254: LED2.+ R2.1
N$53
  Top 0.254: LED1.+ R1.1
N$54  (via drill 0.5)
  Top 0.254: 39.88,10.41 BTN1.0B 40.13,9.97 v39.98,9.35
  Bottom 0.254: R16.1 39.88,8.89 v39.98,9.35
N$55
  Bottom 1.422: JP7.1 JP7.2
N$56  (via drill 0.5)
  Top 0.254: v19.05,9.91 RST.1B
  Bottom 0.254: U$3.P$2 U$2.P$2 24,6.69 | v19.05,9.91 20.07,9.4 21.59,6.86 23.88,6.86 24,6.69 | R17.1 23.43,5.84 24.12,6.53 24,6.69
N$57  (via drill 0.5)
  Top 0.254: Q1.3 v5.51,17.7 | v11.2,19.63 11.56,19.38 11.56,18.09 15.8,15.29 v16.13,15.09 16.1,15.09
  Bottom 0.254: v5.51,17.7 5.38,17.75 5.94,17.7 9.65,17.7 10.03,18.03 11.2,18.06 v11.2,19.63 | v16.13,15.09 R7.2
N$58  (via drill 0.5)
  Top 0.254: v10.92,6.1 12.06,6.5 11.94,6.38 C9.+ | U4.1 12.7,12.13 12.7,10.92 12.6,10.92 12.32,10.64 11.65,10.41 U4.3 11.68,10.51 11.68,6.6 C9.+ | C9.+ 11.91,6.38 11.91,6.43
  Top 0.61: C9.+ 11.94,3.81 13.21,3.81 13.97,3.3 14.73,3.81 15.75,3.81 16.26,4.32 v16.26,7.21
  Bottom 0.254: v16.26,7.21 16.26,6.6 R9.1 | v10.92,6.1 11.43,6.25 D1.2 12.06,6.48 v10.92,6.1
  Bottom 0.406: 19.05,6.6 F1.1
  Bottom 0.508: v16.26,7.21 16.26,5.33 18.03,5.33 18.03,6.6 19.05,6.6
  Bottom 0.813: v16.26,7.21 Q2.2
N$59
  Top 0.254: R14.1 0.51,27.43 0.51,21.08 R13.1 1.29,20.8 1.98,20.78 2.54,20.22 2.52,18.77 Q1.1
PA0  (via drill 0.5)
  Top 0.254: v17.3,19.18 16.08,19.18 15.14,19.51 14.81,19.63 U1.14
  Bottom 0.254: JP6.16 40.66,2.85 40.66,10.72 39.88,11.43 27.18,11.43 26.87,11.86 26.87,13.13 25.3,14.02 22.25,14.02 21.59,14.73 21.92,16.36 20.73,17.5 19.86,19.25 v17.3,19.18
PA1  (via drill 0.5)
  Top 0.254: v44.45,11.18 44.45,3.81 JP6.17 | v16.46,19.86 15.7,19.86 15.32,20.01 U1.15
  Bottom 0.254: v44.45,11.18 44.45,15.65 43.79,16.31 22.63,16.33 21.18,17.7 20.07,19.81 18.29,19.81 17.73,19.96 17.22,19.96 16.76,19.86 v16.46,19.86
PA2  (via drill 0.5)
  Top 0.254: JP9.10 22.35,13.97 21.59,14.73 21.59,16.76 20.42,17.96 20.45,20.98 v20.22,21.23 | v17.09,21.16 15.81,21.02 U1.16
  Bottom 0.254: v20.22,21.23 v17.09,21.16
PA3
  Top 0.254: JP9.9 22.86,16.26 20.93,18.21 20.93,21.67 20.9,22.53 20.12,22.78 19.3,22.96 18.87,22.89 18.57,22.78 17.78,22.81 U1.17
PA4
  Top 0.254: U1.20 19.76,24.28 19.51,24.29 20.05,24.32 21.36,23.16 21.34,19.3 JP9.8
PA5
  Top 0.254: U1.21 19.79,24.79 20.3,24.79 20.95,24.16 21.79,23.39 21.79,21.44 JP9.7
PA6
  Top 0.254: U1.22 20.45,25.3 21.87,24 22,23.87 JP9.6
PA7
  Top 0.254: JP9.5 22.4,25.27 21.69,25.27 20.5,25.81 17.85,25.81 U1.23
PA8
  Top 0.254: JP5.6 13.97,37.03 12.45,37.03 11.81,36.45 U1.41
PA9  (via drill 0.5)
  Top 0.254: v25.4,22.66 25.65,22.86 25.65,36.58 26.42,37.34 v26.67,37.34 | JP5.5 11.31,36.72 U1.42
  Bottom 0.254: U2.2 44.96,17.8 45.09,18.41 44.96,19.3 41.91,22.61 v25.4,22.66 | v26.67,37.34 26.67,39.88 13.97,39.88 JP5.5
PA10  (via drill 0.5)
  Top 0.254: v46.99,39.62 46.48,39.37 11.43,39.37 JP5.4 10.82,36.93 U1.43
  Bottom 0.254: U2.1 46.61,18.54 46.35,19.43 45.87,20.57 45.87,31.88 46.99,31.88 v46.99,39.62
PA13
  Top 0.254: U1.46 9.31,35.64 7.62,37.08 | 7.62,37.08 JP5.3 | 7.62,37.08 R1.2
PA14
  Top 0.254: U1.49 6.37,30.75 6.6,30.99 6.6,33.53 R2.2 5.33,34.29 5.08,34.54 JP5.2
PA15
  Top 0.254: U1.50 6.29,29.77 5.33,29.77 5.33,30.73 5.84,31.24 R3.2 5.59,32.77 5.08,33.53 2.16,33.53 2.16,37.59 JP5.1
PB0
  Top 0.254: JP9.4 22.2,27.3 17.85,27.28 U1.26
PB1
  Top 0.254: JP9.3 22.86,29.46 21.74,28.35 21.69,28.27 21.54,27.79 U1.27
PB2  (via drill 0.5)
  Top 0.254: U1.28 16.86,28.29 16.26,28.3 16.26,25.91 15.75,24.89 15.75,21.84 17.78,21.84 17.78,19.81 18.29,19.3 19.3,19.3 19.3,18.03 18.54,17.27 18.54,14.73 18.29,14.38 17.53,14.38 16.76,13.59 R10.1 16.54,13.51 16.64,13.49 16.61,13.26 17.25,12.62 17.27,7.8 17.78,6.86 18.11,6.5 18.11,4.7 16.76,3.45 16.54,3.3 16.54,2.01 15.72,1.37 6.6,1.37 v6.35,1.78
  Bottom 0.254: JP6.1 3.94,1.47 5.74,1.47 v6.35,1.78
PB3
  Top 0.254: U1.55 6.23,27.3 | U1.55 6.5,27.3 | JP6.2 5.08,3.81 4.06,4.83 4.06,11.68 4.93,12.45 4.93,14.22 6.4,15.77 6.4,16.97 3.05,16.99 3.05,20.34 1.04,22.33 1.02,25.5 2.74,27.28 U1.55
PB4
  Top 0.254: U1.56 6.34,26.77 3,26.77 2.74,26.52 1.52,25.25 1.55,22.48 4.09,19.94 5.44,18.57 5.69,18.57 6.86,17.22 6.86,15.57 5.33,13.97 5.33,12.19 4.57,11.43 4.57,5.08 6.6,3.3 7.37,2.54 JP6.3
PB5
  Top 0.254: JP6.4 9.4,2.54 7.87,4.06 6.6,4.06 5.33,5.08 5.33,9.32 9.25,13.13 9.25,15.8 7.29,16.74 7.29,17.42 5.99,19 5.66,19 2.03,22.63 2.03,24.99 3.23,26.24 6.34,26.26 U1.57
PB6
  Top 0.254: 6.38,25.81 U1.58 6.33,25.76 3.61,25.76 2.54,24.74 2.54,22.73 5.84,19.46 6.17,19.43 7.72,17.6 7.72,17.02 9.65,16.05 9.65,12.95 8.91,12.14 5.84,9.14 5.84,5.33 6.86,4.57 8.13,4.57 9.07,3.61 10.59,3.61 11.68,2.54 JP6.5
PB7  (via drill 0.5)
  Top 0.254: v3.3,23.88 3.28,24.51 4.04,25.27 U1.59
  Bottom 0.254: v3.3,23.88 1.02,23.88 1.02,1.07 15.24,1.07 JP6.6
PB8  (via drill 0.5)
  Top 0.254: v5.08,24.38 5.08,24.29 U1.61
  Bottom 0.254: JP6.7 16.76,0.56 0.51,0.56 0.51,24.64 4.06,24.64 4.57,24.38 v5.08,24.38
PB9  (via drill 0.5)
  Top 0.254: v7.82,24.61 7.32,23.93 7.21,23.82 6.38,23.77 U1.62
  Bottom 0.254: JP6.8 19.56,2.54 18.29,3.81 14.73,3.81 14.73,5.21 10.54,5.21 10.16,4.83 5.33,4.83 5.33,10.92 4.8,11.68 4.8,14.99 4.01,15.8 3.96,16.41 4.32,16.89 4.32,18.87 9.17,18.9 8.43,22.2 8.38,23.37 7.89,24.38 7.84,24.61 v7.82,24.61
PB10
  Top 0.254: JP9.2 22.86,33.07 21.79,31.04 21.79,29.49 21.03,28.8 17.78,28.8 U1.29
PB11
  Top 0.254: JP9.1 22.05,34.01 21.82,33.5 21.59,32 21.59,31.75 21.34,31.24 21.34,29.72 20.88,29.31 17.9,29.31 U1.30
PB12  (via drill 0.5)
  Top 0.254: v24.89,19.05 25.15,18.54 25.2,14.83 v24.87,13.31 | 27.56,8.28 v26.31,10.08 | 27.56,8.28 32.49,8.28 32.49,6.2 BTN1.1A | v17.7,32.92 U1.33 | JP6.9 23.88,5.84 27.56,5.84 27.56,8.28
  Bottom 0.254: v24.89,19.05 21.67,18.92 20.14,20.4 17.14,20.42 16.41,20.62 15.57,20.55 15.57,19.05 13.46,19.05 13.46,21.84 12.57,22.86 12.57,25.73 8.66,24.87 7.11,26.16 7.11,29.52 7.09,29.52 8.94,30.96 10.74,30.2 11.48,30.4 12.5,32.18 15.49,32.26 16.94,32.26 v17.7,32.92 | v24.87,13.31 25.81,11.02 R15.2 v26.31,10.08
PB13  (via drill 0.5)
  Top 0.254: v13.72,26.16 14.88,26.16 15.29,26.57 15.29,31.71 U1.34
  Bottom 0.254: v13.72,26.16 J2.5 15.37,25.45 20.78,25.48 22.1,24.13 23.62,24.13 24.13,25.65 38.86,25.65 41.35,27.96 41.35,31.75 41.91,32.51 41.86,36.07 43.18,37.34 JP5.17
PB14  (via drill 0.5)
  Top 0.254: U1.35 14.76,27.06 13.69,27.08 12.88,27.05 12.9,29.41 12.06,29.97 11.63,30 11.38,29.77 11.38,28.07 11.43,25.04 12.19,24.64 12.75,24.28 13.46,23.88 v13.72,23.98
  Bottom 0.254: v13.72,23.98 15.1,23.47 J2.7 16.79,23.11 18.54,24.89 20.32,24.89 21.59,23.62 21.59,21.59 23.62,21.59 24.89,24.16 39.37,24.16 42.82,27.38 42.85,27.38 42.85,31.88 43.69,31.88 44.25,32.46 44.45,32.89 44.45,34.04 44.35,38.56 43.69,39.37 42.67,39.37 41.4,38.1 JP5.16
PB15  (via drill 0.5)
  Top 0.254: v13.61,27.84 13.61,30.02 14.3,30.58 14.33,31.72 U1.36
  Bottom 0.254: v13.61,27.84 14.11,27.85 J2.3 21.57,27.86 21.54,29.21 23.37,29.21 23.37,29.16 23.9,28.6 24,28.4 24.13,28.22 25.15,28.22 25.55,28.65 35.81,28.65 36.85,29.39 36.85,36.83 JP5.15
PC0  (via drill 0.5)
  Top 0.254: U1.8 11.84,20.84 11.86,20.17 11.96,19.61 11.96,18.39 15.27,16.31 15.82,15.9 v17.07,15.52
  Bottom 0.254: v17.07,15.52 17.09,15.6 18.29,15.75 19.3,14.99 19.36,12.9 22.1,7.87 30.48,7.87 JP6.12
PC1  (via drill 0.5)
  Top 0.254: U1.9 12.37,20.32 12.37,18.64 16,16.56 v16.54,16.41
  Bottom 0.254: v16.54,16.41 18.16,16.43 19.94,15.16 19.91,12.95 22.35,8.38 33.02,8.38 JP6.13
PC2  (via drill 0.5)
  Top 0.254: U1.10 12.83,20.84 12.83,20.19 12.81,18.93 15.37,17.53 15.95,17.2 v17.07,17.22
  Bottom 0.254: v17.07,17.22 18.11,17.12 20.47,15.37 20.47,13.18 22.61,8.89 35.56,8.89 JP6.14
PC3  (via drill 0.5)
  Top 0.254: v21.59,13.72 21.59,12.19 22.07,11.66 26.92,11.66 27.86,11.43 37.85,11.43 v38.33,10.64 | v16.26,17.91 13.34,19.2 13.34,20.24 13.34,20.84 U1.11
  Bottom 0.254: v21.59,13.72 20.98,13.66 20.98,15.65 18.11,17.7 17.27,18.03 v16.26,17.91 | v38.33,10.64 38.35,3.3 JP6.15
PC4  (via drill 0.5)
  Top 0.254: U1.24 20.85,26.29 20.93,26.29 v21.61,26.11
  Bottom 0.254: v21.61,26.11 22.1,26.67 24.13,26.67 25.4,27.15 35.81,27.15 38.35,29.21 38.35,31.75 39.37,32.51 39.37,39.37 36.83,39.37 JP5.14
PC5  (via drill 0.5)
  Top 0.254: v24.11,29.79 23.62,29.46 23.62,28.85 24.13,28.35 24.13,27.43 23.37,26.67 22.61,26.67 22.4,26.82 18.77,26.82 U1.25
  Bottom 0.254: JP5.13 31.75,36.83 31.75,31.98 30.86,31.98 30.61,31.95 25.91,31.95 v24.11,29.79
PC6  (via drill 0.5)
  Top 0.254: v12.95,30.23 13.82,30.86 U1.37
  Bottom 0.254: JP5.12 29.21,36.83 29.21,34.54 28.96,34.27 25.4,34.27 23.42,31.95 21.64,31.95 21.72,34.04 20.32,34.04 19.89,31.14 13.28,31.14 v12.95,30.23
PC7  (via drill 0.5)
  Top 0.254: JP5.11 27.94,36.83 27.18,36.83 v26.67,36.32 | v16.41,34.54 15.44,34.54 15.21,34.09 | 15.21,34.09 15.19,34.04 | 15.21,34.09 14.71,33.15 13.34,33.15 13.31,32.62 U1.38
  Bottom 0.254: v26.67,36.32 24.64,34.29 22.1,34.29 21.59,34.8 21.59,36.32 21.08,36.83 19.3,36.83 16.74,36.78 16.74,35.03 16.46,34.85 v16.41,34.54
PC8  (via drill 0.5)
  Top 0.254: v16.05,35.46 15.42,35.2 14.99,35.05 13.99,33.58 12.83,33.58 12.81,33.16 U1.39
  Bottom 0.254: JP5.10 23.88,39.37 16.51,39.37 v16.05,35.46
PC9
  Top 0.254: U1.40 12.31,33.24 12.32,34.01 13.66,34.01 14.68,35.51 15.57,36.02 16.87,36.63 19.07,36.63 20.57,36.85 21.29,37.57 JP5.9
PC10  (via drill 0.5)
  Top 0.254: JP5.8 18.85,37.06 16.84,37.06 14.3,36.02 13.99,36.02 v13.23,35.87 | v7.49,31.39 7.49,29.57 7.37,29.46 7.2,29.29 U1.51
  Bottom 0.254: v13.23,35.87 12.45,35.81 9.4,35.81 7.87,31.5 7.85,31.42 v7.49,31.39
PC11  (via drill 0.5)
  Top 0.254: JP5.7 15.98,37.21 14.53,36.6 12.65,36.6 12.27,36.2 12.27,34.8 v12.7,34.8 | v4.55,29.49 5.8,28.79 U1.52
  Bottom 0.254: v12.7,34.8 9.65,34.8 8.28,31.11 7.52,30.5 6.76,30.05 v4.55,29.49
PC12  (via drill 0.5)
  Top 0.254: v8.48,28.25 U1.53 | v26.87,6.68 26.72,8.1 25.4,9.91 25.4,10.92 26.92,10.92 27.33,10.52 v27.2,10.67 | v26.16,12.45 26.16,33.02 v26.42,33.27
  Bottom 0.254: JP6.10 U$3.P$1 26.62,4.45 26.72,4.55 27.18,4.57 27.43,4.83 27.43,6.1 26.87,6.66 v26.87,6.68 | v8.48,28.25 12.42,27.99 13.08,29.49 13.97,29.46 13.97,30.73 20.07,30.73 21.57,31.52 23.5,31.52 23.65,31.57 23.7,31.57 25.38,33.38 v26.42,33.27 | v27.2,10.67 26.16,11.46 v26.16,12.45
PC13  (via drill 0.5)
  Top 0.254: U1.2 8.81,21.66 8.15,22.28 7.8,22.28 v7.67,22.25 | v3.3,28.19 R14.2
  Bottom 0.254: v7.67,22.25 7.47,22.25 6.35,23.37 6.35,25.15 v3.3,28.19
PC14
  Top 0.254: U1.3 9.31,20.19 9.12,19.94 7.95,19.94 X2.1 7.72,19.2 8.41,18.44 9.45,18.44 9.45,17.12 9.86,16.89 10.64,16.82 C10.1
PC15  (via drill 0.5)
  Top 0.254: U1.4 9.81,19.98 X2.2 9.04,19.15 9.22,19.15 9.73,18.95 10.26,18.41 10.26,17.93 C11.1 11.12,17.22 14.53,13.51 14.76,13.46 14.76,13.41 | 14.76,13.41 14.81,13.44 | 14.76,13.41 v14.83,13.44
  Bottom 0.254: v14.83,13.44 15.49,12.7 16.26,11.18 19.56,11.18 21.84,7.37 27.94,7.37 JP6.11
PD2  (via drill 0.5)
  Top 0.254: v8.51,27.25 8.38,27.33 7.37,27.79 U1.54
  Bottom 0.254: v8.51,27.25 8.89,26.67 11.94,26.67 12.45,26.92 13.36,28.93 13.69,28.98 J2.2 15.11,28.83 R5.1
USB_DM  (via drill 0.5)
  Top 0.254: U1.44 10.29,25.15 v9.93,24.21
  Bottom 0.254: R12.1 12.78,13.08 13.06,13.56 13.06,16.59 13.21,16.74 13.21,18.29 13.16,18.29 13.06,18.39 13.06,21.61 12.14,22.61 12.14,25.12 11.18,24.89 v9.93,24.21
USB_DP  (via drill 0.5)
  Top 0.254: U1.45 9.8,31.72 9.8,25.98 9.14,24.18 9.4,23.47 v9.55,22.63 | v10.24,19.41 10.67,18.95 11.12,18.47 11.12,17.78 14.58,15.04 v15.09,14.86
  Bottom 0.254: R11.1 13.66,14.43 R7.1 v15.09,14.86 | v9.55,22.63 9.91,22.1 9.91,20.57 v10.24,19.41
USB_VBUS
  Bottom 0.254: R8.2 9.73,7.44 10.16,8.31 10.16,10.76 D1.1 | Q2.1 16.26,9.65
  Bottom 0.406: D1.1 13.3,10.41 15.01,10.39 16.03,10.36 Q2.1
  Bottom 0.508: J1.1 6.65,12.5 D1.1
VBAT
  Top 0.61: JP6.19 46.99,3.81 46.99,6.35 JP10.4
  Bottom 0.406: 20.32,4.57 19.56,4.57 F1.2
  Bottom 0.61: JP5.19 49.53,39.37 52.07,39.37 52.07,1.27 49.53,1.27 JP6.19 46.74,1.02 22.35,1.02 21.59,1.78 21.59,3.3 20.32,4.57
  Bottom 1.422: JP10.4 JP10.3
VDD  (via drill 0.5)
  Top 0.254: C6.1 18.18,30.29 U1.32 15.74,30.29 15.75,29.72 15.75,26.16 15.24,25.15 15.24,23.11 14.48,22.61 v13.72,22.61 14.31,22.01 U1.13 14.33,20.73 14.33,19.3 15.62,18.72 17.8,18.41 | C7.1 7.38,32.24 U1.48 8.31,31.31 8.31,29.11 9.3,28.6 9.3,26.42 9.14,26.16 v8.81,25.65 8.81,24.84 8.69,24.41 7.95,23.6 7.16,22.81 6.37,22.78 U1.64 6.43,22.22 C5.1 7.25,20.84 U1.1 8.31,20.76 | 1.78,17.02 2.01,16.79 Q1.2 1.91,17.14 1.42,17.14 0.89,17.68 R13.2 v1.75,19.96 | 17.8,18.41 17.78,15.75 17.78,14.83 17.14,14.83 17.14,14.76 16.74,14.33 15.72,14.33 15.72,13.03 15.7,12.5 15.01,12.5 14.73,12.45 14.76,12.45 U4.5 14.22,12.25 | v19.63,22.1 19.3,21.03 C4.1 19.81,19.81 v19.91,17.37 | v19.79,23.57 19.39,23.79 U1.19 | 17.8,18.41 v18.41,18.49 | v46.99,11.43 45.21,11.43 44.45,12.19 43.69,11.43 39.01,11.43 39.01,9.91 v37.34,9.91 | v22.1,4.06 21.59,3.56 21.59,0.71
  Top 0.508: 12.7,9.65 13.34,10.59 13.34,11.1 14.22,11.68 14.22,12.25
  Top 0.559: 13.21,6.99 12.7,7.49
  Top 0.61: JP10.6 JP6.18 45.72,2.29 44.65,0.71 21.59,0.71 3.81,0.71 v3.81,4.06 | v46.99,11.43 49.53,11.43 49.53,36.83 46.99,36.83 JP5.18 | 12.7,7.49 12.7,9.65 | v13.95,4.47 13.21,5.08 13.21,6.99
  Bottom 0.254: 30.48,18.02 U2.12 30.23,17.77 30.23,19.3 30.28,19.25 43.84,19.23 44.2,18.92 44.35,18.64 44.35,16.48 44.53,16.36 46.97,16.36 46.99,16.33 v46.99,11.43 | 16.1,26.75 J2.4 15.12,26.75 16.1,26.75 | 16.1,26.75 | 16.1,26.75 C3.1 | 16.1,26.75 16.08,26.77 14.53,26.77 14.17,26.92 13.21,26.92 13.03,26.47 13.03,26.42 | 13.03,26.42 13.03,23.11 13.46,22.61 v13.72,22.61 | 13.03,26.42 v8.81,25.65 | v19.63,22.1 19.81,22.61 v19.79,23.57 | v18.41,18.49 v19.91,17.37 | 13.13,4.5 v13.95,4.47 | R6.2 36.65,9.91 v37.34,9.91 37.59,9.91 R16.2 | v1.75,19.96 1.47,19.63 1.47,6.38 1.78,6.35 | R17.2 22.35,4.32 v22.1,4.06
  Bottom 0.61: JP10.5 43.28,4.98 | v46.99,11.43 46.99,6.35 JP10.6 | C8.+ 3.05,6.35 1.78,6.35 1.65,6.35 1.65,4.06 v3.81,4.06 10.67,4.06 11.1,4.5 13.13,4.5
  Bottom 1.422: JP10.6 JP10.5

### Text on the board
bPlace: + -
tNames: A15 A14A13A10 A9 A8 C11 C10 C9 C8 C7 C6 C5 C4 B15 B14B13 3.3 Bat GND | RST BOOT0 | A2 | A6 A7 B10 B11 | A3 A4 A5 B0 B1 | GND BAT 3.3 | B2 B3 B4 B5 B6 B7 B8 B9 B12 C12C15 C0 C1 C2 C3 A0 A1 3.3 Bat GND
bNames: A15 A14A13A10 A9 A8 C11 C10 C9 C8 C7 C6 C5 C4 B15 B14B13 3.3 Bat GND | RST BOOT0 | Bluetooth | Espruino | Rev 1.3b | www.espruino.com | Designed in England | A2 | A6 A7 B10 B11 | A3 A4 A5 B0 B1 | GND BAT 3.3 | GND BAT 3.3 | B2 B3 B4 B5 B6 B7 B8 B9 B12 C12C15 C0 C1 C2 C3 A0 A1 3.3 Bat GND